# EAGLE design ac-adapter1 (EAGLE 9.6.2)
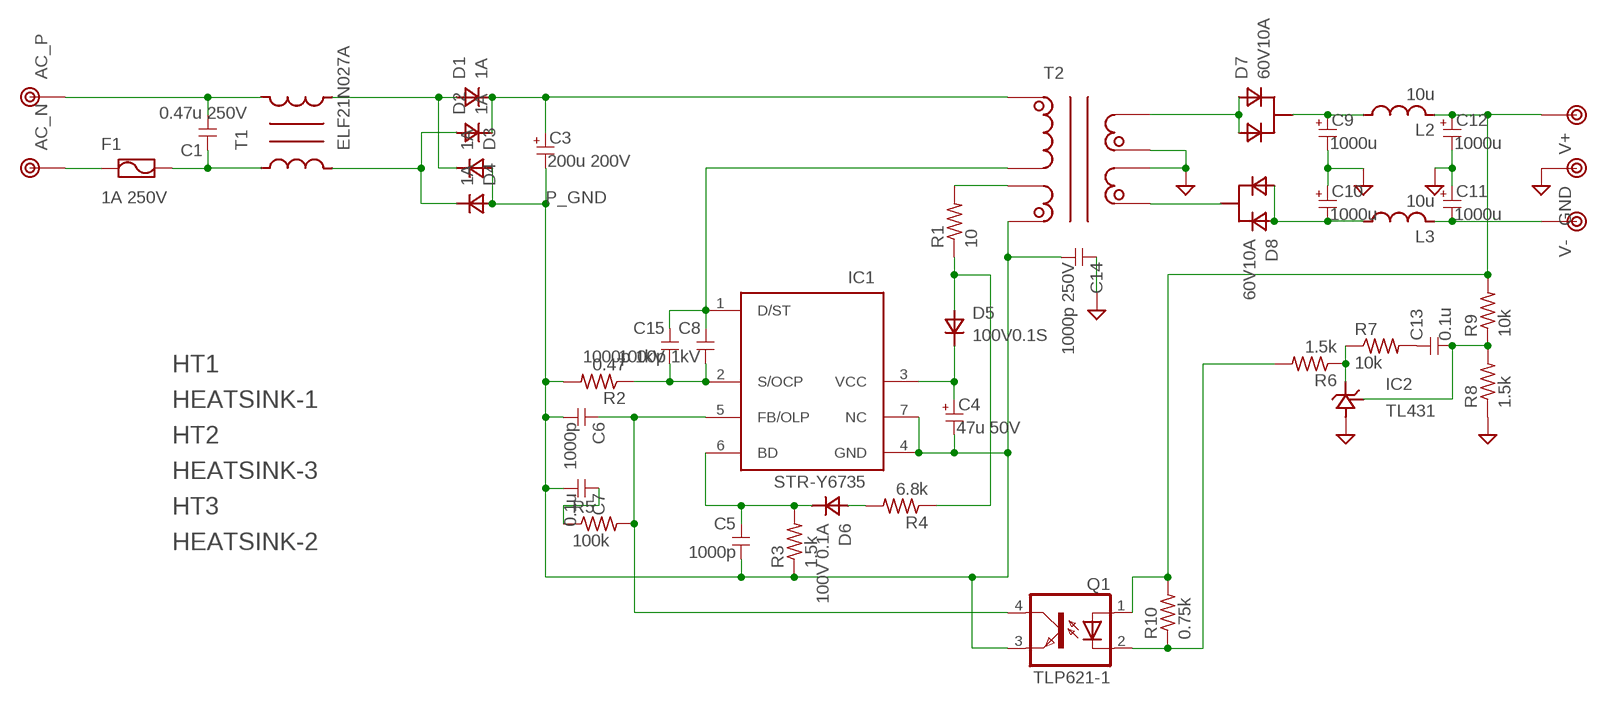
[diagram p0: schematic, sheet 1]

## Parts
C1  0.47u 250V  C-5  [C050-030X075]
C3  200u 200V  CPOLE5-13  [E5-13]
C4  47u 50V  CPOLE2.5-6.5  [E2.5-6.5]
C5  1000p  C-1608  [1608]
C6  1000p  C-1608  [1608]
C7  0.1u  C-1608  [1608]
C8  1000p 1kV  C-5  [C050-030X075]
C9  1000u  CPOLE2.5-8  [E2,5-8]
C10  1000u  CPOLE2.5-8  [E2,5-8]
C11  1000u  CPOLE2.5-8  [E2,5-8]
C12  1000u  CPOLE2.5-8  [E2,5-8]
C13  0.1u  C-1608  [1608]
C14  1000p 250V  C-5  [C050-030X075]
C15  1000p 1kV  C-5  [C050-030X075]
D1  1A  DIODE-7  [D0204/7]
D2  1A  DIODE-7  [D0204/7]
D3  1A  DIODE-7  [D0204/7]
D4  1A  DIODE-7  [D0204/7]
D5  100V0.1S  DIODE-2  [D0207/2V]
D6  100V 0.1A  DIODE-2  [D0207/2V]
D7  60V10A  DIODE2  [TO-220]
D8  60V10A  DIODE2  [TO-220]
F1  1A 250V  FUSE-20MM  [FUSE_20MM]
HT1  HEATSINK-1  [HEATSINK1]
HT2  HEATSINK-3  [HEATSINK3]
HT3  HEATSINK-2  [HEATSINK2]
IC1  STR-Y6735  STR-Y6700-UNIVERSAL  [TO220F-7L-UNIVERSAL]
IC2  TL431  [TO-92]
L2  10u  L-5  [L5-7,5]
L3  10u  L-5  [L5-7,5]
Q1  TLP621-1  [DIL04]
R1  10  R-10  [0207/10]
R2  0.47  R-10  [0207/10]
R3  1.5k  R-1608  [1608]
R4  6.8k  R-2.5  [0207/2V]
R5  100k  R-1608  [1608]
R6  1.5k  R-1608  [1608]
R7  10k  R-1608  [1608]
R8  1.5k  R-1608  [1608]
R9  10k  R-1608  [1608]
R10  0.75k  R-1608  [1608]
T1  ELF21N027A  [ELF21N027A]
T2  TRANSFORMAER_FLYBACK-PQ3535  [BPQ35/35-1112CPFR]
TP1  AC_P  TESTPIN  [TESTPIN]
TP2  AC_N  TESTPIN  [TESTPIN]
TP3  V+  TESTPIN  [TESTPIN]
TP4  V-  TESTPIN  [TESTPIN]
TP5  GND  TESTPIN  [TESTPIN]

## Nets
GND: C9.- C10.+ C11.+ C12.- C14.1 IC2.2(GND) R8.1 T2.9(L3_P) T2.10(L4_N) TP5.1
N$1: F1.1-1 F1.1-2 TP2.1
N$2: C1.1 F1.2-1 F1.2-2 T1.1
N$3: C1.2 T1.4 TP1.1
N$4: D2.1(A) D4.2(K) T1.2
N$5: D7.1(A1) D7.3(A2) T2.8(L3_N)
N$6: C8.1 C15.1 IC1.1(D/ST) T2.3(L1_N)
N$7: D1.1(A) D3.2(K) T1.3
N$8: C3.+ D1.2(K) D2.2(K) T2.1(L1_P)
N$9: C4.+ D5.2(K) IC1.3(VCC)
N$10: D5.1(A) R1.1 R4.1
N$11: R1.2 T2.5(L2_N)
N$12: C8.2 C15.2 IC1.2(S/OCP) R2.1
N$13: D6.1(A) R4.2
N$14: C5.1 D6.2(K) IC1.6(BD) R3.2
N$15: C6.1 IC1.5(FB/OLP) Q1.4(COL) R5.2
N$16: C7.1 R5.1
N$17: D8.2(K) T2.11(L4_P)
N$19: C10.- D8.1(A1) D8.3(A2) L3.P$1
N$20: C9.+ D7.2(K) L2.P$1
N$21: C13.2 IC2.1(REF) R8.2 R9.1
N$22: C12.+ L2.P$2 Q1.1(A) R9.2 R10.2 TP3.1
N$23: C11.- L3.P$2 TP4.1
N$24: IC2.3(OUT) R6.1 R7.1
N$25: C13.1 R7.2
N$26: Q1.2(C) R6.2 R10.1
P_GND: C3.- C4.- C5.2 C6.2 C7.2 C14.2 D3.1(A) D4.1(A) IC1.4(GND) IC1.7(NC) Q1.3(EMIT) R2.2 R3.1 T2.4(L2_P)

## Library data of the parts
C1 C5-C8 C13-C15 = my_rcl:C
C3 C4 C9-C12 = my_rcl:CPOL
D1-D6 = my_rcl:DIODE
D7 D8 = my_rcl:DIODE2
F1 = my_rcl:FUSE
HT1-HT3 = my_connector:HEATSINK
IC1 = my_ic:STR-Y6700
IC2 = my_ic:TL431
L2 L3 = my_rcl:L
Q1 = my_ic:TLP621-1: Photocoupler
R1-R10 = my_rcl:R
T1 = my_rcl:ELF21N027A
T2 = my_rcl:TRANSFORMAER_FLYBACK
TP1-TP5 = my_connector:TESTPIN

## Board
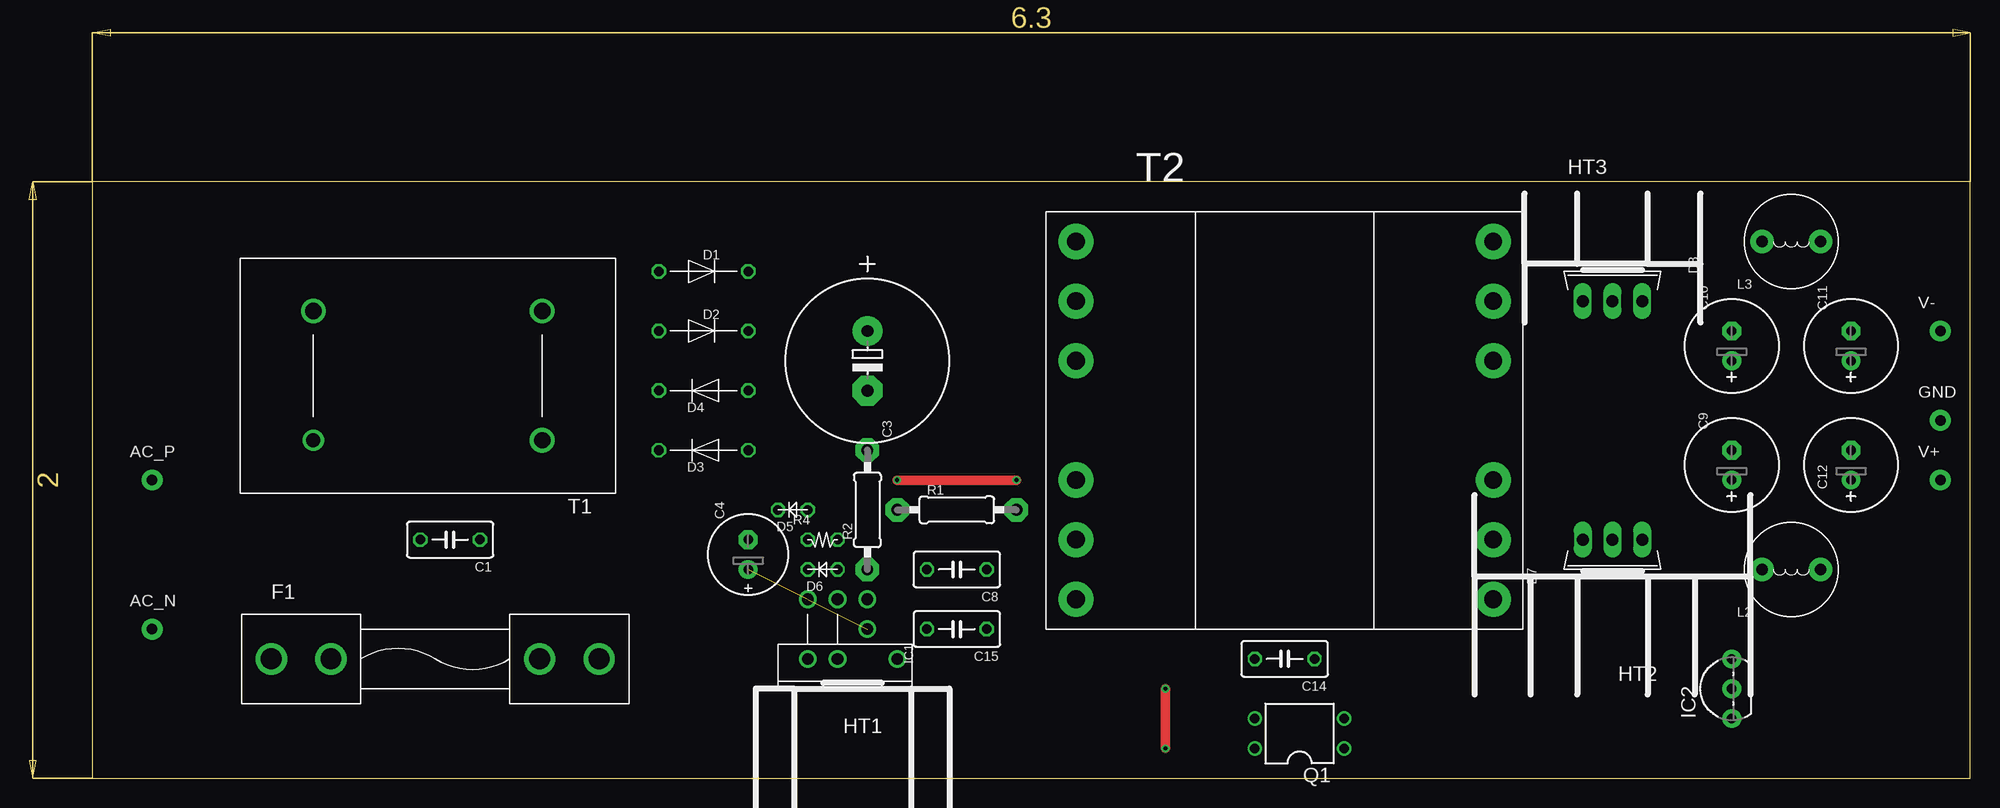
[diagram p1: board, top side]
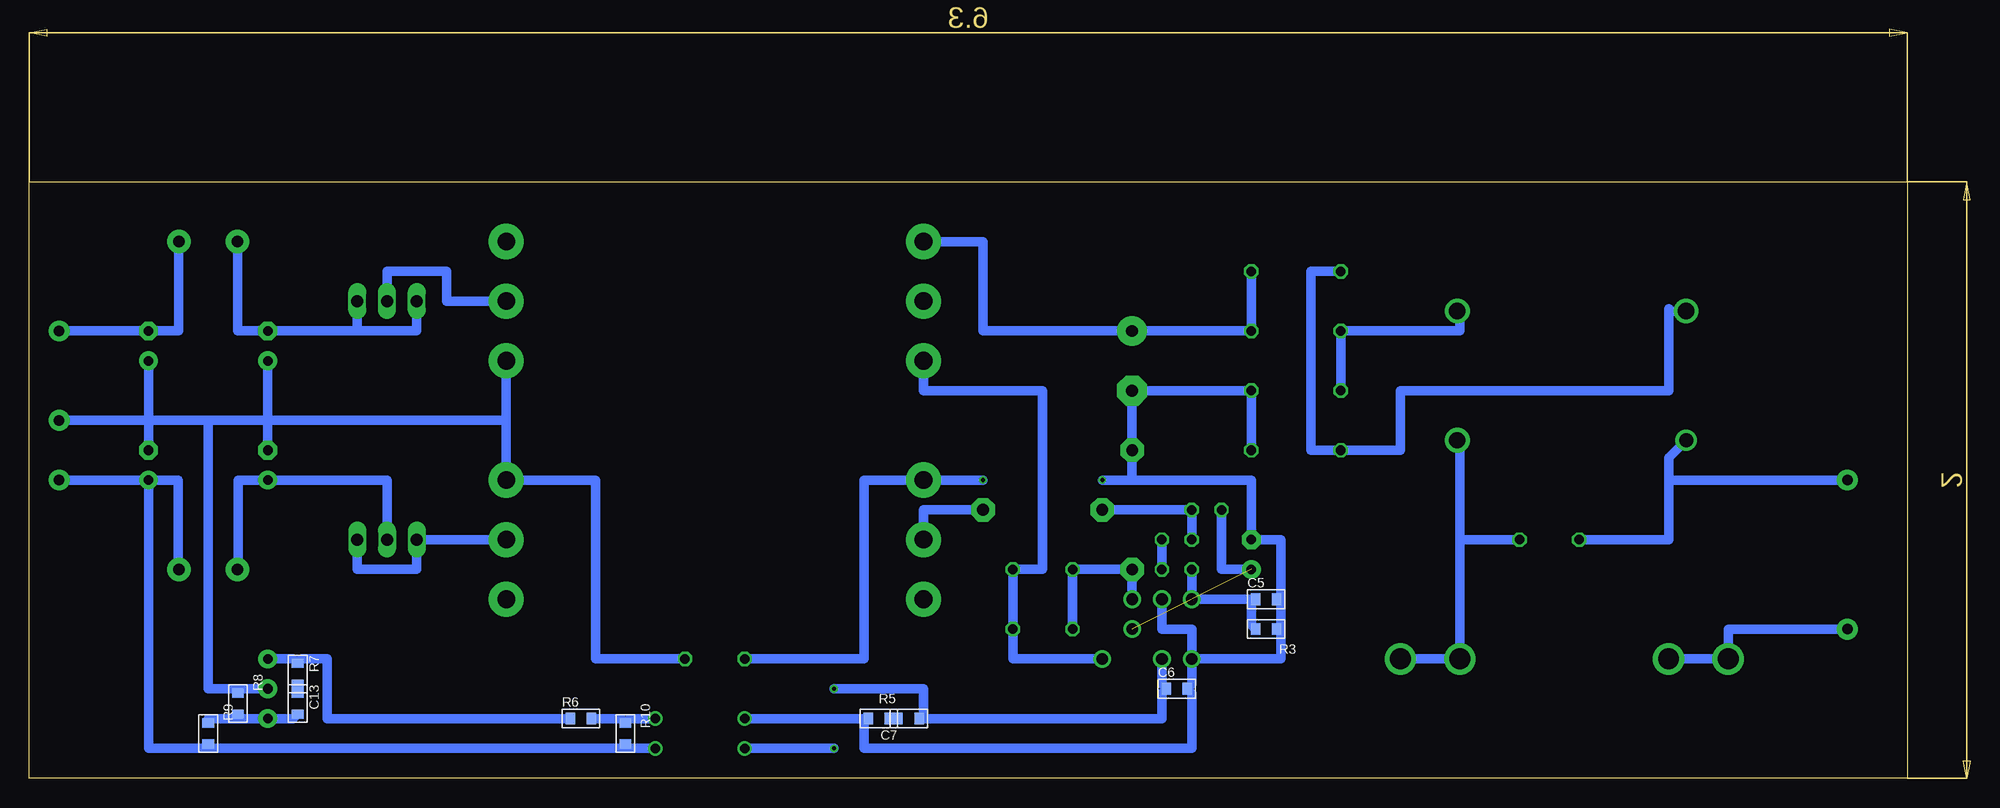
[diagram p2: board, bottom side, seen from below]

Size 160.02 x 50.8 mm. Coordinates in mm from the lower left corner, seen from the top.
Outline: 0,0 160.02,0 160.02,50.8 0,50.8 0,0
Copper layers (1*16): Top 0.035mm / dielectric 1.5mm / Bottom 0.035mm
Design rules "SeeedStudio_2layer_DRU_20140221": minimum track width 6mil, minimum drill 0.3mm, track to track 8mil, track to pad 8mil, pad to pad 8mil, via to via 12mil, smd to smd 0mil, copper to edge 0.3mm, drill to drill 10mil, minimum pad ring 0.15mm, minimum via ring 6mil, stop-mask expansion 2mil, vias tented up to drill 1mm, thermal gap 10mil

### Footprints (pad centres in the part's own frame; a part is rotated, then mirrored left to right if it is on the bottom)
C050-030X075 = drill 0.813 octagon: 1 -2.54,0; 2 2.54,0
E5-13 = drill 1.016 pad 2.54: + -2.54,0 | drill 1.016 pad 2.54 octagon: - 2.54,0
E2.5-6.5 = drill 0.813 pad 1.6: + -1.27,0 | drill 0.813 pad 1.6 octagon: - 1.27,0
1608 = smd 0.8 x 1: 1 -0.9,0; 2 0.9,0
E2,5-8 = drill 0.813 pad 1.6: + -1.27,0 | drill 0.813 pad 1.6 octagon: - 1.27,0
D0204/7 = drill 0.813 octagon: 1 -3.81,0; 2 3.81,0
D0207/2V = drill 0.813 octagon: 1 -1.27,0; 2 1.27,0
TO-220 = drill 1.016 long: 1 -2.54,0; 2 0,0; 3 2.54,0
FUSE_20MM = drill 1.778: 1-1 -15.24,0; 1-2 -10.16,0; 2-1 7.62,0; 2-2 12.7,0
TO220F-7L-UNIVERSAL = drill 1: 1 -3.81,0; 2 -1.27,-5.08; 3 -1.27,-2.54; 4 1.27,-5.08; 5 1.27,0; 6 3.81,-5.08; 7 3.81,0
TO-92 = drill 0.813 pad 1.6: 1 -2.54,0; 2 0,0; 3 2.54,0
L5-7,5 = drill 1 pad 2: P$1 2.5,0; P$2 -2.5,0
DIL04 = drill 0.813: 1 -1.27,-3.81; 2 1.27,-3.81; 3 1.27,3.81; 4 -1.27,3.81
0207/10 = drill 1 pad 2 octagon: 1 -5.08,0; 2 5.08,0
0207/2V = drill 0.813 octagon: 1 -1.27,0; 2 1.27,0
ELF21N027A = drill 1.4: 1 -9.75,5.5; 2 -9.75,-5.5; 3 9.75,-5.5 | drill 1.2: 4 9.75,5.5
BPQ35/35-1112CPFR = drill 1.5 pad 3: 1 -17.78,15.24; 2 -17.78,10.16; 3 -17.78,5.08; 4 -17.78,-5.08; 5 -17.78,-10.16; 6 -17.78,-15.24; 7 17.78,-15.24; 8 17.78,-10.16; 9 17.78,-5.08; 10 17.78,5.08; 11 17.78,10.16; 12 17.78,15.24
TESTPIN = drill 0.9 pad 1.778: 1 0,0

### Placement (x,y rotation side)
C1  30.48,20.32 180 top
C3  66.04,35.56 270 top
C4  55.88,19.05 90 top
C5  54.61,15.24 0 bottom
C6  62.23,7.62 0 bottom
C7  87.63,5.08 180 bottom
C8  73.66,17.78 180 top
C9  139.7,26.67 90 top
C10  139.7,36.83 90 top
C11  149.86,36.83 90 top
C12  149.86,26.67 90 top
C13  137.16,6.35 270 bottom
C14  101.6,10.16 180 top
C15  73.66,12.7 180 top
D1  52.07,43.18 0 top
D2  52.07,38.1 0 top
D3  52.07,27.94 180 top
D4  52.07,33.02 180 top
D5  59.69,22.86 180 top
D6  62.23,17.78 180 top
D7  129.54,20.32 180 top
D8  129.54,40.64 0 top
F1  30.48,10.16 0 top
HT1  64.77,7.62 180 top
HT2  129.54,17.14 180 top
HT3  129.54,43.81 0 top
IC1  64.77,10.16 180 top
IC2  139.7,7.62 90 top
L2  144.78,17.78 180 top
L3  144.78,45.72 180 top
Q1  102.87,3.81 90 top
R1  73.66,22.86 0 top
R2  66.04,22.86 90 top
R3  54.61,12.7 180 bottom
R4  62.23,20.32 0 top
R5  85.09,5.08 0 bottom
R6  113.03,5.08 0 bottom
R7  137.16,8.89 270 bottom
R8  142.24,6.35 270 bottom
R9  144.78,3.81 270 bottom
R10  109.22,3.81 270 bottom
T1  28.57,34.29 180 top
T2  101.6,30.48 0 top
TP1  5.08,25.4 0 top
TP2  5.08,12.7 0 top
TP3  157.48,25.4 0 top
TP4  157.48,38.1 0 top
TP5  157.48,30.48 0 top

### Tracks (layer width: path | path; a pad name or v marks a point on that pad's centre or on a via)
GND
  Bottom 0.813: T2.10 119.38,30.48 | 119.38,30.48 T2.9 111.76,25.4 111.76,10.16 C14.1 | C10.+ 139.7,30.48 | 139.7,30.48 C9.- | 149.86,30.48 C12.- | C11.+ 149.86,30.48 | 149.86,30.48 144.78,30.48 | 144.78,30.48 139.7,30.48 | 144.78,30.48 144.78,7.62 141.87,7.62 | 149.86,30.48 TP5.1 | 139.7,30.48 119.38,30.48 | IC2.2 141.87,7.62 | 141.87,7.62 R8.1
N$1
  Bottom 0.813: TP2.1 15.24,12.7 F1.1-1 F1.1-2
N$2
  Bottom 0.813: 38.1,20.32 38.1,28.57 T1.1 | C1.1 38.1,20.32 | 38.1,20.32 F1.2-1 F1.2-2
N$3
  Bottom 0.813: 20.32,25.4 20.32,20.32 C1.2 | 20.32,25.4 20.32,27.3 T1.4 | TP1.1 20.32,25.4
N$4
  Bottom 0.813: D4.2 D2.1 38.1,38.1 38.1,39.56 T1.2
N$5
  Bottom 0.813: T2.8 D7.3 127,17.78 132.08,17.78 D7.1
N$6
  Bottom 0.813: T2.3 83.82,33.02 73.66,33.02 73.66,17.78 C8.1 C15.1 76.2,10.16 IC1.1
N$7
  Bottom 0.813: D1.1 50.8,43.18 50.8,27.94 D3.2 43.18,27.94 43.18,33.02 20.32,33.02 20.32,40.01 20.11,39.79 T1.3
N$8
  Bottom 0.813: D1.2 D2.2 C3.+ 78.74,38.1 78.74,45.72 T2.1
N$9  (1 unrouted)
  Bottom 0.813: C4.+ 58.42,17.78 D5.2
N$10
  Bottom 0.813: R1.1 D5.1 R4.1
N$11
  Bottom 0.813: T2.5 83.82,22.86 R1.2
N$12
  Bottom 0.813: IC1.2 R2.1 C8.2 C15.2
N$13
  Bottom 0.813: D6.1 R4.2
N$14
  Bottom 0.813: 55.88,15.24 IC1.6 D6.2 | C5.1 55.88,15.24 | R3.2 55.88,13.07 55.88,15.24
N$15  (via drill 0.35)
  Top 0.813: v91.44,7.62 v91.44,2.54
  Bottom 0.813: IC1.5 63.5,7.99 C6.1 63.5,7.25 63.5,5.08 R5.2 83.82,5.45 83.82,7.62 v91.44,7.62 | v91.44,2.54 Q1.4
N$16
  Bottom 0.813: R5.1 C7.1
N$17
  Bottom 0.813: T2.11 124.46,40.64 124.46,43.18 129.54,43.18 D8.2
N$19
  Bottom 0.813: L3.P$1 142.28,38.14 142.24,38.1 C10.- 132.08,38.1 | D8.1 127,38.1 132.08,38.1 | D8.3 132.08,38.1
N$20
  Bottom 0.813: L2.P$1 142.24,17.82 142.24,25.4 C9.+ 129.54,25.4 D7.2
N$21
  Bottom 0.813: C13.2 137.53,5.08 IC2.1 141.87,5.08 | 141.87,5.08 144.78,5.08 R9.1 | R8.2 141.87,5.08
N$22
  Bottom 0.813: C12.+ 147.32,25.4 147.32,17.82 L2.P$2 | C12.+ 149.86,2.54 144.78,2.54 | Q1.1 109.22,2.54 R10.2 109.59,2.54 144.78,2.54 | C12.+ TP3.1 | R9.2 144.78,2.54
N$23
  Bottom 0.813: L3.P$2 147.28,38.14 147.32,38.1 C11.- TP4.1
N$24
  Bottom 0.813: IC2.3 137.53,10.16 R7.1 136.79,10.16 134.62,10.16 134.62,5.08 R6.1
N$25
  Bottom 0.813: C13.1 R7.2
N$26
  Bottom 0.813: Q1.2 108.85,5.08 R10.1 109.59,5.08 R6.2
P_GND  (via drill 0.35)
  Top 0.813: v78.74,25.4 v68.58,25.4
  Bottom 0.813: D3.1 D4.1 C3.- R2.2 66.04,25.4 | IC1.4 63.5,12.7 60.96,12.7 IC1.7 | IC1.7 53.34,10.16 53.34,12.33 | IC1.7 60.96,7.99 C6.2 60.96,7.25 60.96,2.54 88.9,2.54 88.9,5.08 | C14.2 88.9,10.16 88.9,25.4 T2.4 v78.74,25.4 | 88.9,5.08 Q1.3 | 53.34,15.24 53.34,20.32 C4.- 55.88,25.4 66.04,25.4 | 53.34,15.24 53.34,13.07 | 53.34,13.07 R3.1 53.34,12.33 | 53.34,13.07 53.34,12.33 | C5.2 53.34,15.24 | 66.04,25.4 v68.58,25.4 | C7.2 88.9,5.08